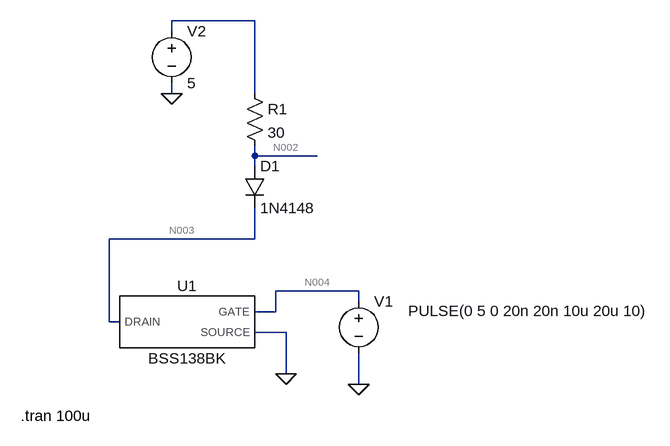
[diagram p0: schematic SvetoDiode.asc]
SvetoDiode.asc, the LTspice schematic file:
Version 4.1
SHEET 1 936 680
WIRE 304 -144 176 -144
WIRE 176 -128 176 -144
WIRE 176 -32 176 -48
WIRE 304 -32 304 -144
WIRE 304 64 304 48
WIRE 400 64 304 64
WIRE 304 80 304 64
WIRE 304 192 304 144
WIRE 304 192 80 192
WIRE 464 272 336 272
WIRE 464 288 464 272
WIRE 336 304 336 272
WIRE 336 304 304 304
WIRE 80 320 80 192
WIRE 96 320 80 320
WIRE 352 336 304 336
WIRE 352 400 352 336
WIRE 464 416 464 368
FLAG 176 -32 0
FLAG 352 400 0
FLAG 464 416 0
SYMBOL diode 288 80 R0
SYMATTR InstName D1
SYMATTR Value 1N4148
SYMBOL res 288 -48 R0
SYMATTR InstName R1
SYMATTR Value 30
SYMBOL voltage 464 272 R0
WINDOW 3 76 31 Left 2
WINDOW 123 0 0 Left 0
WINDOW 39 0 0 Left 0
SYMATTR Value PULSE(0 5 0 20n 20n 10u 20u 10)
SYMATTR InstName V1
SYMBOL voltage 176 -144 R0
WINDOW 123 0 0 Left 0
WINDOW 39 0 0 Left 0
SYMATTR InstName V2
SYMATTR Value 5
SYMBOL BSS138BK 192 320 R0
SYMATTR InstName U1
TEXT -56 464 Left 2 !.tran 100u

The netlist it stands for:
* SvetoDiode.asc
D1 N002 N003 1N4148
R1 N001 N002 30
V1 N004 0 PULSE(0 5 0 20n 20n 10u 20u 10)
V2 N001 0 5
X§U1 N003 N004 0 BSS138BK  ; pins DRAIN GATE SOURCE
.model D D
.lib standard.dio
.tran 100u
.lib C:\Users\User\Downloads\BSS138BK_30_01_2012.lib
.backanno
.end

* Results of the author's LTspice run, read from the files saved beside the schematic
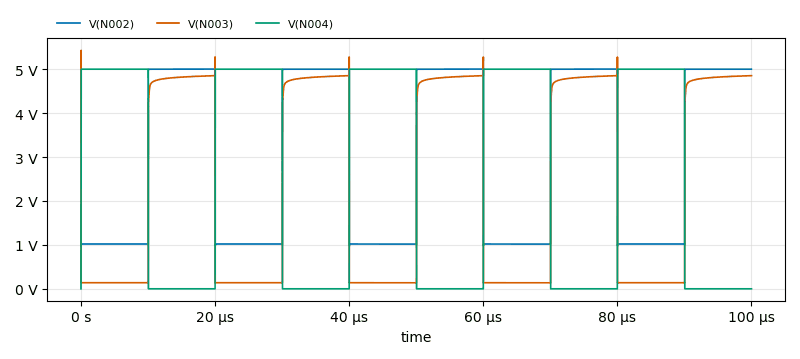
[diagram p1: Transient Analysis of SvetoDiode.asc, plotted from the saved traces]
* Transient Analysis, 1 run:
*   V(N002): min 981.1 mV, max 5.011 V, average 3.004 V, rms 3.603 V, last 5 V
*   V(N003): min 129.8 mV, max 5.429 V, average 2.462 V, rms 3.39 V, last 4.852 V
*   V(N004): min 0 V, max 5 V, average 2.505 V, rms 3.538 V, last 0 V